# Altium schematic sheet Buck_Converters.SchDoc
size A; SheetNumber: 2; SheetTotal: 6
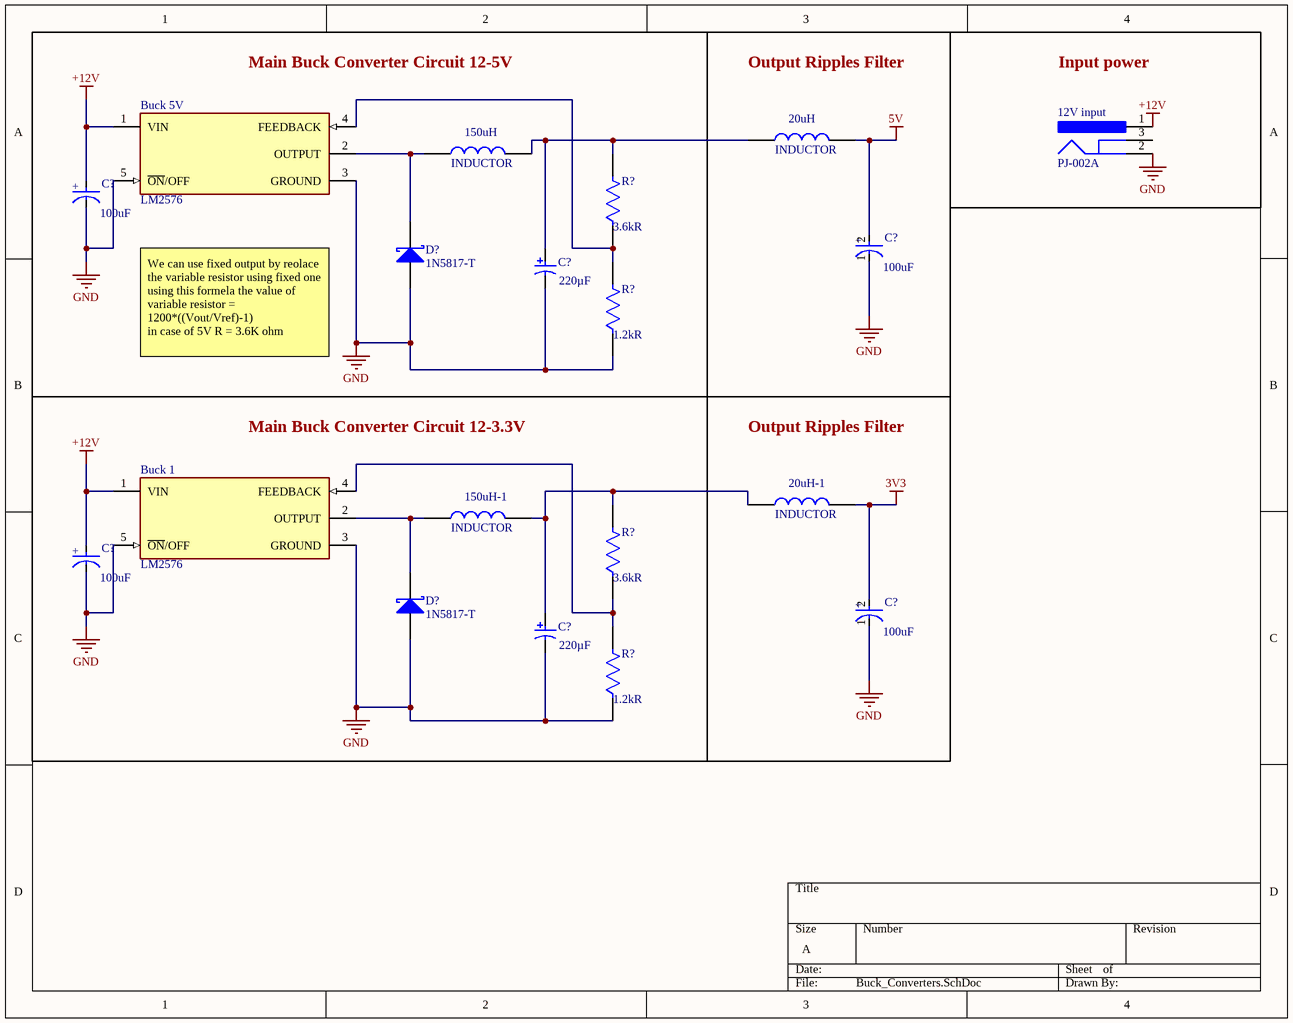
[diagram p0: Buck_Converters.SchDoc]

## Parts
(Parts that share a designator on the sheet are numbered #1, #2 ... from top to bottom, then left to right.)
12V_input  PJ-002A  [CUI-PJ-002A_V]
20uH  INDUCTOR  [AXIAL0.3]
20uH-1  INDUCTOR  [AXIAL0.3]
150uH  INDUCTOR  [AXIAL0.3]
150uH-1  INDUCTOR  [AXIAL0.3]
Buck_1  LM2576  [FP-C04-036-MFG]
Buck_5V  LM2576  [FP-C04-036-MFG]
C?#1  Capacitance: 100uF  [FP-RAD-TH-D_6_3_0_5-L_7_1-MFG]  (hidden comment: ECEA1CKA101I)
C?#2  Capacitance: 100uF  [FP-RAD-TH-D_6_3_0_5-L_7_1-MFG]  (hidden comment: ECEA1CKA101I)
C?#3  Capacitance: 220µF  [PNSC-ECA-1VM221-2]  (hidden comment: ECA-1VM221)
C?#4  Capacitance: 100uF  [FP-RAD-TH-D_6_3_0_5-L_7_1-MFG]  (hidden comment: ECEA1CKA101I)
C?#5  Capacitance: 100uF  [FP-RAD-TH-D_6_3_0_5-L_7_1-MFG]  (hidden comment: ECEA1CKA101I)
C?#6  Capacitance: 220µF  [PNSC-ECA-1VM221-2]  (hidden comment: ECA-1VM221)
D?#1  1N5817-T  [DIOD-DO-41-P-2]
D?#2  1N5817-T  [DIOD-DO-41-P-2]
R?#1  Resistance: 3.6kR  [FP-MRS25-MFG]  (hidden comment: MRS25000C1001FCT00)
R?#2  Resistance: 1.2kR  [FP-MRS25-MFG]  (hidden comment: MRS25000C1001FCT00)
R?#3  Resistance: 3.6kR  [FP-MRS25-MFG]  (hidden comment: MRS25000C1001FCT00)
R?#4  Resistance: 1.2kR  [FP-MRS25-MFG]  (hidden comment: MRS25000C1001FCT00)

## Nets
3V3: 20uH-1.2 C?#5.2(A)
5V: 20uH.2 C?#2.2(A)
+12V: 12V_input.1 Buck_1.1(VIN) Buck_5V.1(VIN) C?#1.2(A) C?#4.2(A)
GND: 12V_input.2 Buck_1.3(GROUND) Buck_1.5(~{ON}/OFF) Buck_5V.3(GROUND) Buck_5V.5(~{ON}/OFF) C?#1.1(C) C?#2.1(C) C?#3.2 C?#4.1(C) C?#5.1(C) C?#6.2 D?#1.1(A) D?#2.1(A) R?#2.1 R?#4.1
Net20uH-1_1: 20uH-1.1 150uH-1.2 C?#6.1 R?#3.2
Net20uH_1: 20uH.1 150uH.2 C?#3.1 R?#1.2
Net150uH-1_1: 150uH-1.1 Buck_1.2(OUTPUT) D?#2.2(K)
Net150uH_1: 150uH.1 Buck_5V.2(OUTPUT) D?#1.2(K)
NetBuck_1_4: Buck_1.4(FEEDBACK) R?#3.1 R?#4.2
NetBuck_5V_4: Buck_5V.4(FEEDBACK) R?#1.1 R?#2.2

Not connected (* = marked no-connect by the designer): 12V_input 3

## Notes on the sheet
- Main Buck Converter Circuit 12-5V
- Output Ripples Filter
- Input power
- We can use fixed output by reolace the variable resistor using fixed one
  using this formela the value of variable resistor = 1200*((Vout/Vref)-1)
  in case of 5V R = 3.6K ohm
- Main Buck Converter Circuit 12-3.3V
- (in symbol CMP-05427-001316-1) +

## Library data of the parts
12V_input = CMP-2000-06895-2: Through Hole Right Angle DC Power Jack, 2.5 A, 2 mm Center Pin, 3 Position, -25 to 85 degC, RoHS, Bulk; Manufacturer: CUIInc.; Brand: CUI; Inside Contact Diameter: 2mm; Voltage Rating: 24V; Outside Contact Diameter: 6.5mm; Current Rating: 2.5A; Insulation Resistance: 50MOhms; Contact Gender: Male; Connector Type: DCPowerJack; Datasheet Version: Rev. 1.03, 04/2016; Housing Material: PolybutyleneTerephthalate(PBT); Operating Temperature Range: -25Cto+85C; Termination Style: ThroughHole; Product Category: DCPowerConnectors; Mounting Technology: ThroughHole; Mounting Style: ThroughHole; Factory Pack Quantity: 500; Contact Plating: Nickel; Package Reference: PJ-002A; Mounting Angle: Right; Package Description: 3-Pin Through Hole Device, Body 14.4 x 9 mm, Height 11 mm; Flammability Rating: UL94V-0; Manufacturer URL: http://www.cui.com/; Product: Jacks; Contact Material: Copper; Datasheet URL: http://www.cui.com/product/resource/pj-002a.pdf; RoHS: True
Buck_1 Buck_5V = CMP-06325-000071-1: IC REG BUCK 5V 3A TO220-5; Min Input Voltage: 4V; Switching Frequency: 52kHz; Efficiency: 82%; Number of Outputs: 1; Output Type: Fixed; Output Configuration: Positive; Max Input Voltage: 40V; Synchronous Rectifier: No; Nominal Output Voltage: 5V; Number of Pins: 5; Lead Free: Lead Free; Width: 4.83mm; Min Operating Temperature: -40°C; Switching Frequency-Max: 52kHz; Mount: Through Hole; Package Quantity: 50; Max Operating Temperature: 85°C; Output Current: 3A; Height: 9.17mm; Radiation Hardening: No; Case/Package: TO-220; Output Voltage: 5V; RoHS Compliant: Yes; Length: 10.67mm; Series: -; Min Output Voltage: 5V; Packaging: Rail/Tube; Max Output Current: 3A; Reach SVHC Compliant: Yes
C?#1 C?#2 C?#4 C?#5 = CMP-05427-001316-1: Aluminum Electrolytic Capacitors (Radial Lead Type) 100uF ±20% 16V; Life (Hours): 1000Hour; Lead Diameter: 0.45mm; Polarity: Polar; Ripple Current: 91mA; Series: KA; Packaging: Tape and Reel; Voltage Rating: 16V; Voltage Rating (DC): 16V; Min Operating Temperature: -40°C; Lead Pitch: 2.5mm; Mount: Through Hole; Height - Seated (Max): 0.315inch; Package Quantity: 2000; Length: 7mm; Termination: Radial; Voltage: 16V; Diameter: 6.3mm; Height: 7mm; Radiation Hardening: No; RoHS Compliant: Yes; Tolerance: 20%; Case/Package: Radial; Max Operating Temperature: 85°C
C?#3 C?#6 = CMP-2000-05311-1: Aluminum Electrolytic Capacitor, 220 uF, +/- 20%, 35 V, -40 to 85 degC, 2-Pin THD, RoHS, Bulk; Manufacturer: Panasonic; Lifetime@Temperature: 2000Hrs@85degC; Rated Voltage: 35V; Ripple Current: 350mA; Type: Radial; Package Reference: ECA-1VM221; Series: M; Operating Temp Range: -40to+85degC; Package Description: 2-Pin Axial Lead, Dia 8 mm, Body Length 12.5 mm; Datasheet Version: Mar-06; Datasheet URL: https://datasheet.ciiva.com/26341/441851-da-01-en-elko-eca1vm221-m-r-220myf-35v-85c-26341906.pdf; Operating Temp-Max: 85degC; Case Size/Dimension: Ø8x11.5mm; Manufacturer URL: http://www.panasonic.com/
D?#1 D?#2 = CMP-2000-05521-1: Schottky Barrier Rectifier, 1 A, 20 V, -65 to 125 degC, 2-Pin DO-41, RoHS, Tape and Reel; Manufacturer: DiodesIncorporated; Vrrm - Repetitive Reverse Voltage: 20V; If - Forward Current: 1A; Configuration: Single; Unit Weight: 0.010582oz; Type: SchottkyDiode; Ifsm - Forward Surge Current: 25A; Vf - Forward Voltage: 0.75Vat3A; Ir - Reverse Current: 1000uA; Technology: Si; Length: 5.21mm; Product: SchottkyRectifiers; Package Reference: DO-41-P-2; Package / Case: DO-41; Datasheet URL: http://www.diodes.com/_files/datasheets/ds23001.pdf; Operating Temperature Range: -65Cto+125C; Mounting Style: ThroughHole; Manufacturer URL: http://www.diodes.com/; Series: 1N58; Minimum Operating Temperature: -65C; Height: 2.72mm; Brand: DiodesIncorporated; Maximum Operating Temperature: +125C; Datasheet Version: Rev. 8-2, 05/2009; Factory Pack Quantity: 5000; Width: 2.72mm; RoHS: True; Product Category: SchottkyDiodes&Rectifiers; Package Description: 2-Pin Through Hole Device, Body 4.635 x 2.36 mm, Pin Spacing 7.85 mm; Packaging: Reel; Termination Style: ThroughHole; Mounting Technology: ThroughHole
R?#1-R?#4 = CMP-02408-000051-1: RES 1K OHM 0.6W 1% AXIAL; Power Rating: 600mW; Lead Diameter: 0.6mm; Voltage Rating (DC): 350V; Temperature Coefficient: 50ppm/°C; Width: 2.5mm; Military Standard: Not; Package Quantity: 5000; Radiation Hardening: No; Case/Package: Axial; Resistance Tolerance: 1%; Resistor Type: Metal Film; Contact Plating: Tin; Length: 6.5mm; Lead Free: Lead Free; RoHS Compliant: Yes; Mount: Through Hole; Number of Pins: 2; Technology: THIN FILM; Voltage Rating: 350V; Min Operating Temperature: -55°C; Weight: 0.00776oz; Diameter: 2.5mm; Construction: Cylindrical; Series: MRS25; Tolerance: 1%; Packaging: Tape and Reel; Max Operating Temperature: 155°C; Max Power Dissipation: 600mW; Number of Terminations: 2; Termination: Axial